# Altium schematic sheet Main.SchDoc
size Letter
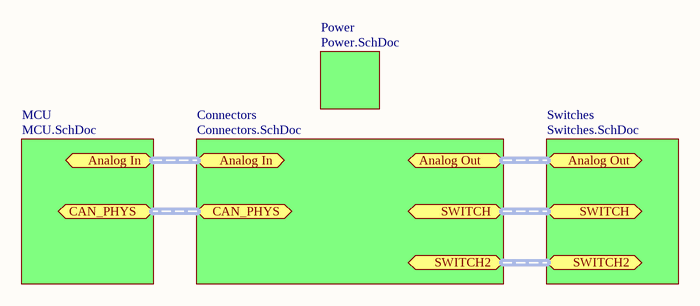
[diagram p0: Main.SchDoc]

## Sub-sheets
Connectors = Connectors.SchDoc: no entries
MCU = MCU.SchDoc: no entries
Power = Power.SchDoc: no entries
Switches = Switches.SchDoc: no entries

## Ports
Analog In (harness Analog_In), Analog Out (harness Analog_Out), CAN_PHYS (harness CAN_PHYS), SWITCH2 (harness SWITCH2), SWITCH (harness SWITCH)